# EAGLE schematic gps-to-spi (EAGLE 7.1.0)
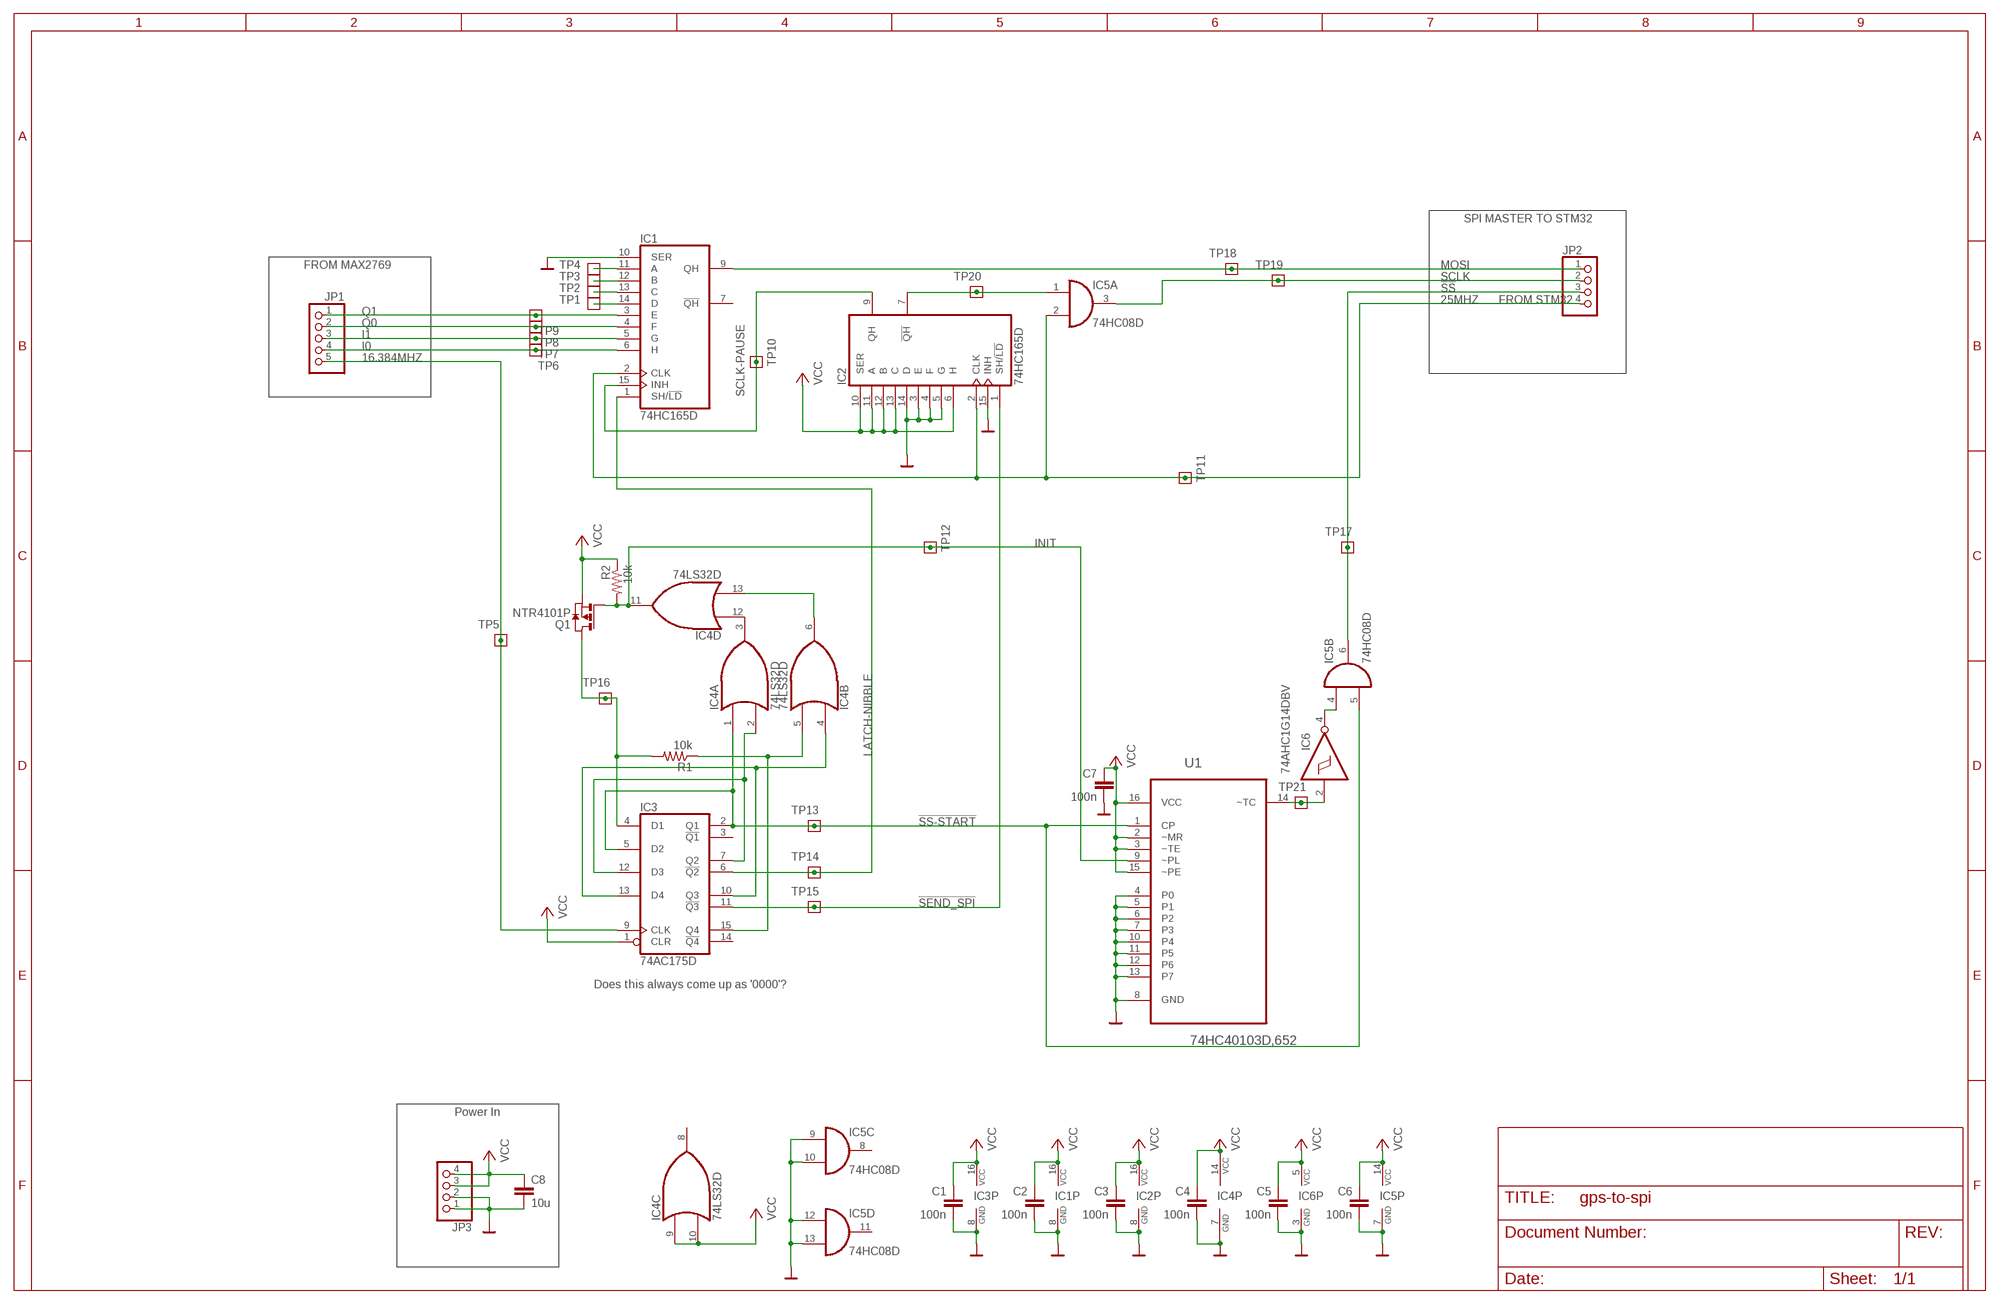
[diagram p0: schematic, sheet 1]

## Parts
C1  100n  C-EU0603-B-NOSILK  [.0603-B-NOSILK]
C2  100n  C-EU0603-B-NOSILK  [.0603-B-NOSILK]
C3  100n  C-EU0603-B-NOSILK  [.0603-B-NOSILK]
C4  100n  C-EU0603-B-NOSILK  [.0603-B-NOSILK]
C5  100n  C-EU0603-B-NOSILK  [.0603-B-NOSILK]
C6  100n  C-EU0603-B-NOSILK  [.0603-B-NOSILK]
C7  100n  C-EU0603-B-NOSILK  [.0603-B-NOSILK]
C8  10u  C-EU0603-B-NOSILK  [.0603-B-NOSILK]
IC1  74HC165D  [SO16]
IC2  74HC165D  [SO16]
IC3  74AC175D  [SO16]
IC4  74LS32D  [SO14]
IC5  74HC08D  [SO14]
IC6  74AHC1G14DBV  [SOT23-5]
JP1  PINHD-1X5  [1X05]
JP2  PINHD-1X4  [1X04]
JP3  PINHD-1X4  [1X04]
Q1  NTR4101P  [SOT23]
R1  10k  R-US_0603-B-NOSILK  [.0603-B-NOSILK]
R2  10k  R-US_0603-B-NOSILK  [.0603-B-NOSILK]
TP1  TEST-POINT  [2MM-TEST-POINT]
TP2  TEST-POINT  [2MM-TEST-POINT]
TP3  TEST-POINT  [2MM-TEST-POINT]
TP4  TEST-POINT  [2MM-TEST-POINT]
TP5  TEST-POINT  [2MM-TEST-POINT]
TP6  TEST-POINT  [2MM-TEST-POINT]
TP7  TEST-POINT  [2MM-TEST-POINT]
TP8  TEST-POINT  [2MM-TEST-POINT]
TP9  TEST-POINT  [2MM-TEST-POINT]
TP10  TEST-POINT  [2MM-TEST-POINT]
TP11  TEST-POINT  [2MM-TEST-POINT]
TP12  TEST-POINT  [2MM-TEST-POINT]
TP13  TEST-POINT  [2MM-TEST-POINT]
TP14  TEST-POINT  [2MM-TEST-POINT]
TP15  TEST-POINT  [2MM-TEST-POINT]
TP16  TEST-POINT  [2MM-TEST-POINT]
TP17  TEST-POINT  [2MM-TEST-POINT]
TP18  TEST-POINT  [2MM-TEST-POINT]
TP19  TEST-POINT  [2MM-TEST-POINT]
TP20  TEST-POINT  [2MM-TEST-POINT]
TP21  TEST-POINT  [2MM-TEST-POINT]
U1  74HC40103D,652  [SOIC127P600X175-16N]

## Nets
16.384MHZ: IC3.9(CLK) JP1.5 TP5.1
25MHZ: IC1.2(CLK) IC2.2(CLK) IC5.2(A:I1) JP2.4 TP11.1
!SEND_SPI: IC2.1(SH/!LD) IC3.11(!Q3) TP15.1
!SS: IC5.6(B:O) JP2.3 TP17.1
!SS-START: IC3.2(Q1) IC3.5(D2) IC4.1(A:I0) IC5.5(B:I1) TP13.1 U1.1(CP)
GND: C1.2 C2.2 C3.2 C4.2 C5.2 C6.2 C7.2 C8.2 IC1.8(GND) IC1.10(SER) IC2.3(E) IC2.4(F) IC2.5(G) IC2.8(GND) IC2.14(D) IC2.15(INH) IC3.8(GND) IC4.7(P:GND) IC5.7(P:GND) IC5.9(C:I0) IC5.10(C:I1) IC5.12(D:I0) IC5.13(D:I1) IC6.3(GND) JP3.1 JP3.2 U1.4(P0) U1.5(P1) U1.6(P2) U1.7(P3) U1.8(GND) U1.10(P4) U1.11(P5) U1.12(P6) U1.13(P7)
I0: IC1.6(H) JP1.4 TP6.1
I1: IC1.5(G) JP1.3 TP7.1
INIT: IC4.11(D:O) Q1.1(G) R2.2 TP12.1 U1.9(~PL)
LATCH-NIBBLE: IC1.1(SH/!LD) IC3.6(!Q2) TP14.1
MOSI: IC1.9(QH) JP2.1 TP18.1
N$2: IC3.7(Q2) IC3.12(D3) IC4.2(A:I1)
N$3: IC3.10(Q3) IC3.13(D4) IC4.4(B:I0)
N$4: IC3.15(Q4) IC4.5(B:I1) R1.1
N$5: IC3.4(D1) Q1.3(D) R1.2 TP16.1
N$6: IC4.3(A:O) IC4.12(D:I0)
N$8: IC4.6(B:O) IC4.13(D:I1)
N$12: IC5.4(B:I0) IC6.4(O)
N$13: IC2.7(!QH) IC5.1(A:I0) TP20.1
N$14: IC6.2(I) TP21.1 U1.14(~TC)
N$15: IC1.14(D) TP1.1
N$16: IC1.13(C) TP2.1
N$17: IC1.12(B) TP3.1
N$18: IC1.11(A) TP4.1
Q0: IC1.4(F) JP1.2 TP8.1
Q1: IC1.3(E) JP1.1 TP9.1
SCLK: IC5.3(A:O) JP2.2 TP19.1
SCLK-PAUSE: IC1.15(INH) IC2.9(QH) TP10.1
VCC: C1.1 C2.1 C3.1 C4.1 C5.1 C6.1 C7.1 C8.1 IC1.16(VCC) IC2.6(H) IC2.10(SER) IC2.11(A) IC2.12(B) IC2.13(C) IC2.16(VCC) IC3.1(CLR) IC3.16(VCC) IC4.9(C:I0) IC4.10(C:I1) IC4.14(P:VCC) IC5.14(P:VCC) IC6.5(VCC) JP3.3 JP3.4 Q1.2(S) R2.1 U1.2(~MR) U1.3(~TE) U1.15(~PE) U1.16(VCC)
Unconnected: IC1.7(!QH) IC3.3(!Q1) IC3.14(!Q4) IC4.8(C:O) IC5.8(C:O) IC5.11(D:O)

## Notes on the sheet
- SPI MASTER TO STM32
- FROM MAX2769
- FROM STM32
- Does this always come up as '0000'?
- Power In

## Library data of the parts
C1-C8 = rcl_custom:C-EU: CAPACITOR, European symbol
IC1 IC2 = 74xx-eu:74*165: 8-bit parallel load SHIFT REGISTER
IC3 = 74xx-eu:74*175: Qadruple D type FLIP FLOP, clear
IC4 = 74xx-us:74*32: Quad 2-input OR gate
IC5 = 74xx-eu:74*08: Quad 2-input AND gate
IC6 = 74xx-little-us:74*1G14: Single Schmitt-Trigger Inverter Gate
JP1 = pinhead:PINHD-1X5: PIN HEADER
JP2 JP3 = pinhead:PINHD-1X4: PIN HEADER
Q1 = Tova:NTR4101P
R1 R2 = rcl_custom:R-US_: RESISTOR, American symbol
TP1-TP21 = Tova:TEST-POINT
U1 = gps-to-spi:74HC40103D,652: 8-bit synchronous binary down counter; MPN: 74HC40103D,652; OC_FARNELL: 1868601; OC_NEWARK: 71R2431; PACKAGE: SOIC-16; SUPPLIER: NXP